# Altium schematic sheet Schematic.SchDoc
size 273 x 213 mm
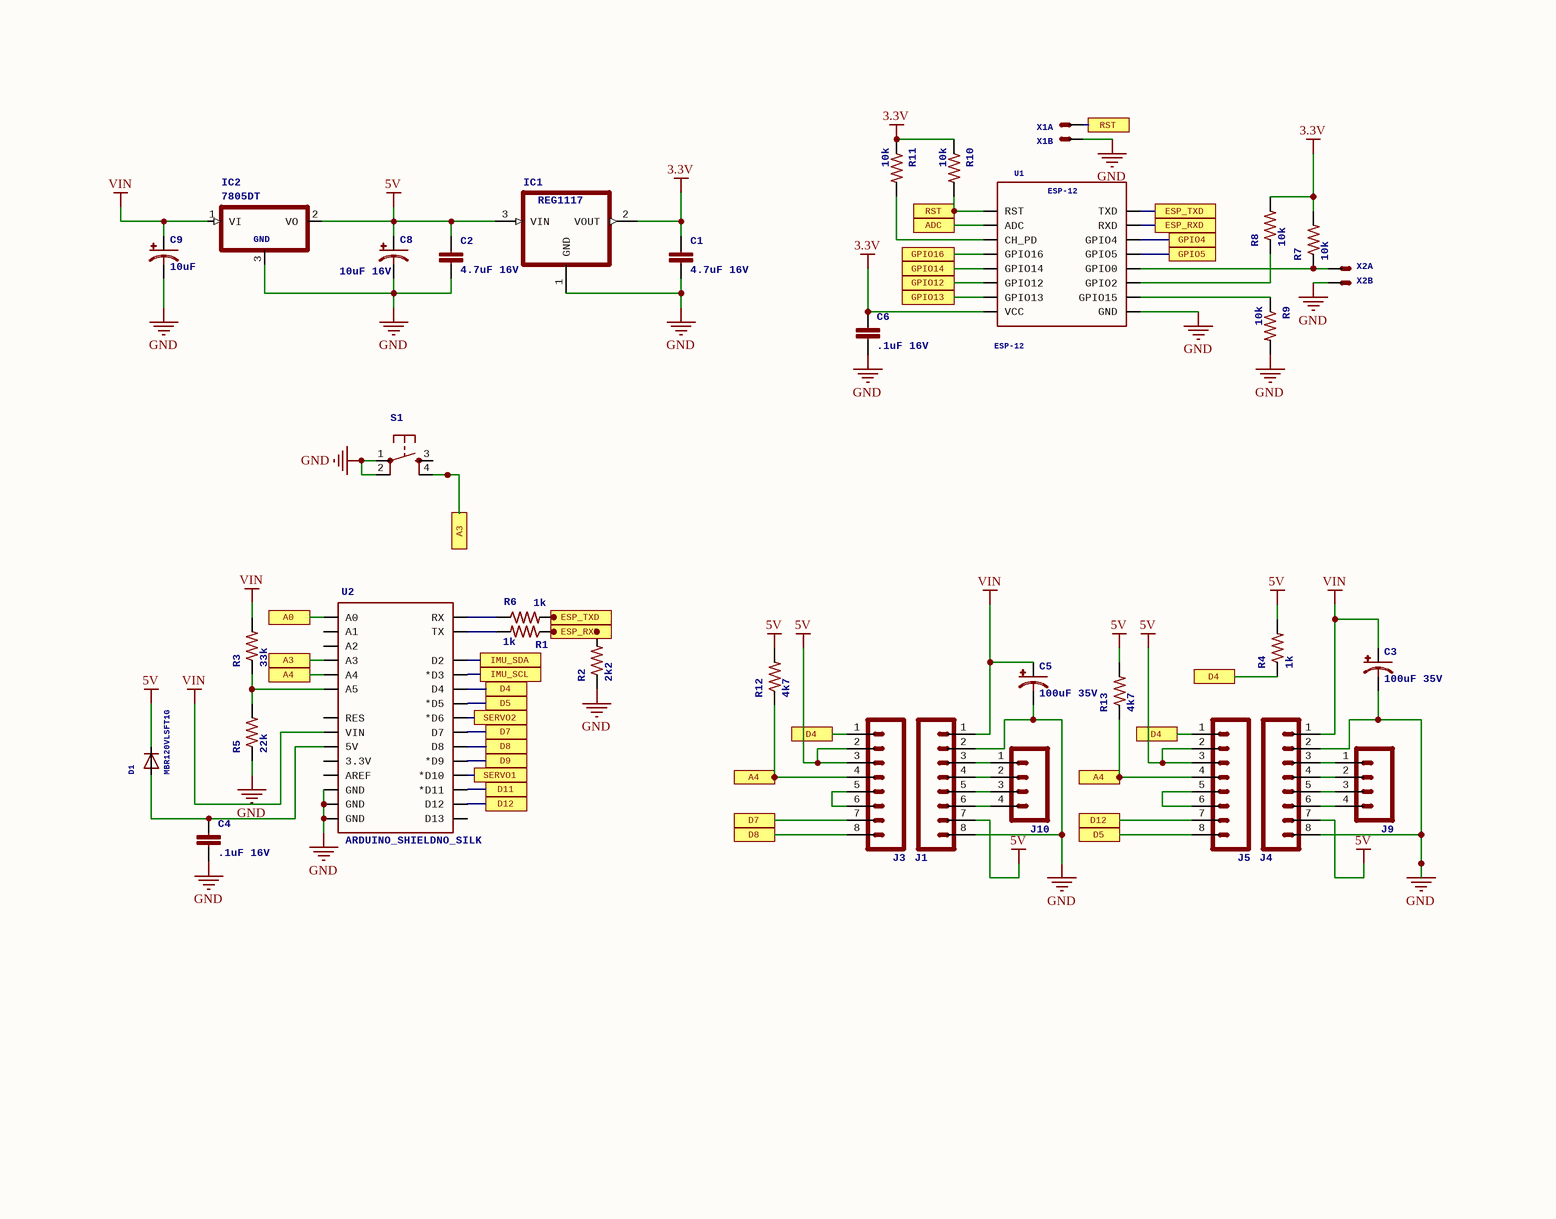
[diagram p0: Schematic.SchDoc]

## Parts
C1  4.7uF 16V  [1206-CAP]
C2  4.7uF 16V  [1206-CAP]
C3  100uF 35V  [PANASONIC_D]
C4  .1uF 16V  [0603-CAP]
C5  100uF 35V  [PANASONIC_D]
C6  .1uF 16V  [0603-CAP]
C8  10uF 16V  [EIA3216]
C9  10uF  [EIA3216]
D1  MBR120VLSFT1G  [SOD-123]
IC1  REG1117  [SOT223]
IC2  7805DT  [TO252]
J1  PRT-11543  [1X08_SMD]  (value not drawn)
J3  PRT-11543  [1X08_SMD]  (value not drawn)
J4  PRT-11543  [1X08_SMD]  (value not drawn)
J5  PRT-11543  [1X08_SMD]  (value not drawn)
J9  M04SMD_STRAIGHT_REVERSED  [1X04_SMD_STRAIGHT_REVERSED]  (value not drawn)
J10  M04SMD_STRAIGHT_REVERSED  [1X04_SMD_STRAIGHT_REVERSED]  (value not drawn)
R1  1k  [0603-RES]
R2  2k2  [0603-RES]
R3  33k  [0603-RES]
R4  1k  [0603-RES]
R5  22k  [0603-RES]
R6  1k  [0603-RES]
R7  10k  [0603-RES]
R8  10k  [0603-RES]
R9  10k  [0603-RES]
R10  10k  [0603-RES]
R11  10k  [0603-RES]
R12  4k7  [0603-RES]
R13  4k7  [0603-RES]
S1  TAC_SWITCHSMD  [TACTILE_SWITCH_SMD]  (value not drawn)
U1  ESP-12  [ESP-12_SMD]
U2  ARDUINO_SHIELDNO_SILK  [DUEMILANOVE_VIAS]
X1  87758-0216  [87758-0216]  (value not drawn)  (parts A,B of 2)
X2  87758-0216  [87758-0216]  (value not drawn)  (parts A,B of 2)

## Ports
A0, A3, A4, ADC, D4, D5, D7, D8, D9, D11, D12, ESP_RXD, ESP_TXD, GPIO4, GPIO5, GPIO12, GPIO13, GPIO14, GPIO16, IMU_SCL, IMU_SDA, RST, SERVO1, SERVO2

## Nets
3.3V: C1.P$1 C6.1 IC1.2(VOUT) R7.2 R8.2 R10.1 R11.1 U1.S8(VCC)
5V: C2.P$1 C8.A(+) D1.C IC1.3(VIN) IC2.2(VO) J1.7 J3.2 J3.3 J4.7 J5.2 J5.3 R4.2 R12.2 R13.2
GND: C1.P$2 C2.P$2 C3.- C4.2 C5.- C6.2 C8.C(-) C9.C(-) IC1.1(GND) IC2.3(GND) J1.2 J1.8 J4.2 J4.8 R2.1 R5.1 R9.2 S1.1 S1.2 U1.S9(GND) U2.GND@0(GND) U2.GND@1(GND) U2.GND@2(GND) X1.2(S) X2.2(S)
VIN: C3.+ C5.+ C9.A(+) IC2.1(VI) J1.1 J4.1 R3.2 U2.VIN
A0: U2.A0 ; port A0
A3: U2.A3 ; port A3
A4: J3.4 J5.4 R12.1 R13.1 U2.A4 ; port A4
ADC: U1.S2(ADC) ; port ADC
D4: J3.1 J5.1 R4.1 U2.D4 ; port D4
D5: J5.8 U2.D5(*D5) ; port D5
D7: J3.7 U2.D7 ; port D7
D8: J3.8 U2.D8 ; port D8
D9: U2.D9(*D9) ; port D9
D11: U2.D11(*D11) ; port D11
D12: J5.7 U2.D12 ; port D12
ESP_RXD: U1.S15(RXD) ; port ESP_RXD
ESP_TXD: U1.S16(TXD) ; port ESP_TXD
GPIO4: U1.S14(GPIO4) ; port GPIO4
GPIO5: U1.S13(GPIO5) ; port GPIO5
GPIO12: U1.S6(GPIO12) ; port GPIO12
GPIO13: U1.S7(GPIO13) ; port GPIO13
GPIO14: U1.S5(GPIO14) ; port GPIO14
GPIO16: U1.S4(GPIO16) ; port GPIO16
IMU_SCL: U2.D3(*D3) ; port IMU_SCL
IMU_SDA: U2.D2 ; port IMU_SDA
RST: R10.2 U1.S1(RST) X1.1(S) ; port RST
SERVO1: U2.D10(*D10) ; port SERVO1
SERVO2: U2.D6(*D6) ; port SERVO2
NetC4_1: C4.1 D1.A U2.5V
NetJ1_3: J1.3 J10.1
NetJ1_4: J1.4 J10.2
NetJ1_5: J1.5 J10.3
NetJ1_6: J1.6 J10.4
NetJ3_5: J3.5 J3.6
NetJ4_3: J4.3 J9.1
NetJ4_4: J4.4 J9.2
NetJ4_5: J4.5 J9.3
NetJ4_6: J4.6 J9.4
NetJ5_5: J5.5 J5.6
NetR1_2: R1.2 U2.TX
NetR3_1: R3.1 R5.2 U2.A5
NetR6_1: R6.1 U2.RX
NetR7_1: R7.1 U1.S12(GPIO0) X2.1(S)
NetR8_1: R8.1 U1.S11(GPIO2)
NetR9_1: R9.1 U1.S10(GPIO15)
NetR11_2: R11.2 U1.S3(CH_PD)

Not connected (* = marked no-connect by the designer): R1 1; R2 2; R6 2; S1 3 4; U2 3.3V A1 A2 AREF D13 RES

## Library data of the parts
C1 C2 = CAP1206: CapacitorStandard 0603 ceramic capacitor, and 0.1" leaded capacitor.; GateName_1: G$1; SymbolName_1: CAP; DeviceName: 1206; LibraryName: pixhawk2; DeviceSetName: CAP
C3 C5 = CAP_POLD: Capacitor PolarizedThese are standard SMD and PTH capacitors. Normally 10uF, 47uF, and 100uF in electrolytic and tantalum varieties. Always verify the external diameter of the through hole cap, it varies with capacity, voltage, and manufacturer. The EIA devices should be standard.; GateName_1: G$1; DeviceName: D; SymbolName_1: CAP_POL; LibraryName: SparkFun-Passives; DeviceSetName: CAP_POL
C4 C6 = CAP0603-CAP: CapacitorStandard 0603 ceramic capacitor, and 0.1" leaded capacitor.; GateName_1: G$1; SymbolName_1: CAP; DeviceName: 0603-CAP; LibraryName: SparkFun-Passives; DeviceSetName: CAP
C8 C9 = CAP_POL1206: Capacitor PolarizedThese are standard SMD and PTH capacitors. Normally 10uF, 47uF, and 100uF in electrolytic and tantalum varieties. Always verify the external diameter of the through hole cap, it varies with capacity, voltage, and manufacturer. The EIA devices should be standard.; GateName_1: G$1; DeviceName: 1206; SymbolName_1: CAP_POL; LibraryName: SparkFun-Passives; DeviceSetName: CAP_POL
D1 = DIODESOD-123: Diode   SMADIODE - SMA Surface Mount Package  20V 1A Schottky Diode Digikey: 641-1014-6-ND    DO-1N4148 - Through Hole Small Current Diode SOD-123 20V 1 A (.5mV Vf) Schottky Diode - Digikey: MBRX120TPMSCT-ND    SOD-323 10V 570mA (.38mV Vf, 3ns) Schottky Diode - Digikey: ZLLS410CT-ND    SOD-523 30V 30mA Schottky Diode (RB751S-40TE61) - Digikey: RB751S-40TE61CT-ND    SOT23-R/W - SOT23 Package (R = Solder Paste/Reflow Ovens, W = Hand-Soldering)  BAT54Film 40V 300mA - Digikey: 497-7162-1-ND; GateName_1: G$1; SymbolName_1: DIODE; DeviceName: SOD-123; LibraryName: adafruit; DeviceSetName: DIODE
IC1 = REG1117: 800mA and 1A Low Dropout (LDO) Positive Regulator   1.8V, 2.5V, 2.85V, 3.3V, 5V, and Adj; GateName_1: G$1; SymbolName_1: REG1118; LibraryName: burr-brown; DeviceSetName: REG1117; MF: *; MPN: REG1117; OC_FARNELL: 1097566; OC_NEWARK: 14P6981
IC2 = 78*DT: Positive VOLTAGE REGULATOR   Source: http://cache.national.com/ds/LM/LM78L05.pdf http://www.fairchildsemi.com/ds/LM/LM7805.pdf; GateName_1: A1; SymbolName_1: 78XX; DeviceName: DT; DeviceSetName: 78*; LibraryName: linear; GND: GND
J1 J3-J5 = M08SMD-STRAIGHT-FEMALE: Header 8Standard 8-pin 0.1" header. Use with straight break away headers (SKU : PRT-00116), right angle break away headers (PRT-00553), swiss pins (PRT-00743), machine pins (PRT-00117), and female headers (PRT-00115).; GateName_1: G$1; SymbolName_1: M08; PROD_ID: CONN-10204; DeviceName: SMD-STRAIGHT-FEMALE; LibraryName: SparkFun-Connectors; DeviceSetName: M08
J9 J10 = M04SMD_STRAIGHT_REVERSED: Header 4Standard 4-pin 0.1" header. Use with straight break away headers (SKU : PRT-00116), right angle break away headers (PRT-00553), swiss pins (PRT-00743), machine pins (PRT-00117), and female headers (PRT-00115). Molex polarized connector foot print use with SKU : PRT-08231 with associated crimp pins and housings. 1MM SMD Version SKU: PRT-10208; GateName_1: G$1; SymbolName_1: M04; DeviceName: SMD_STRAIGHT_REVERSED; LibraryName: #mRo; DeviceSetName: M04
R1-R13 = RESISTOR0603-RES: ResistorBasic schematic elements and footprints for 0603, 1206, and PTH resistors.; GateName_1: G$1; SymbolName_1: RESISTOR; DeviceName: 0603-RES; LibraryName: SparkFun-Passives; DeviceSetName: RESISTOR
S1 = TAC_SWITCHSMD: Momentary SwitchButton commonly used for reset or general input. Spark Fun Electronics SKU : COM-00097; GateName_1: S; SymbolName_1: SWITCH-MOMENTARY; DeviceName: SMD; LibraryName: DIYdrones3; DeviceSetName: TAC_SWITCH
U1 = ESP-12: ESP8266 ESP-12 WIFI Module; GateName_1: G$1; SymbolName_1: ESP-12; LibraryName: #mRo; DeviceSetName: ESP-12; ESP-12: ESP-12
U2 = ARDUINO_SHIELDNO_SILK: Arduino shield footprint; GateName_1: G$1; SymbolName_1: ARDUINO_SHIELD; DeviceName: NO_SILK; LibraryName: SparkFun-Boards; DeviceSetName: ARDUINO_SHIELD
X1 X2 = 87758-0216: 2 Pin - 2mm Dual Row Single Wafer, Vertical T/H HDR   Source: http://www.molex.com/pdm_docs/sd/877580616_sd.pdf; GateName_1: -1; SymbolName_1: MV; GateName_2: -2; SymbolName_2: MV; LibraryName: con-molex; DeviceSetName: 87758-0216; MF: *; MPN: 87758-0216; OC_FARNELL: unknown; OC_NEWARK: 94M1513